# EAGLE design tokaleds (EAGLE 8.5.0)
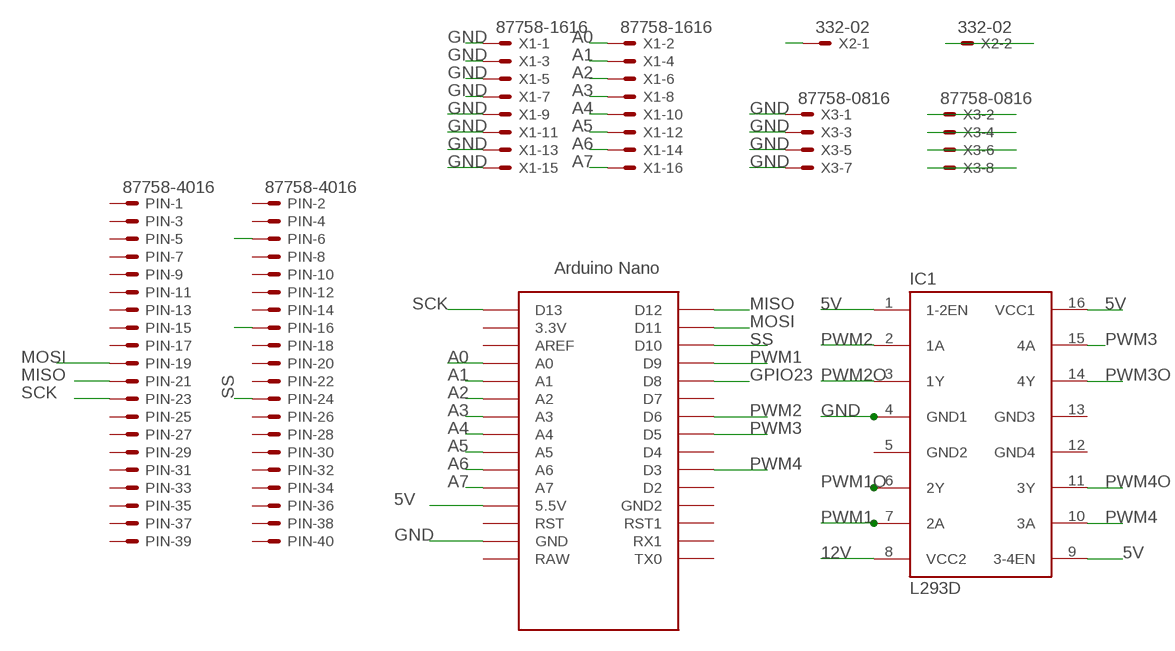
[diagram p0: schematic, sheet 1]

## Parts
IC1  L293D  [DIL16]
PIN  87758-4016  [87758-4016]
U$1  NANO  [NANO]
X1  87758-1616  [87758-1616]
X2  332-02  [332-02]
X3  87758-0816  [87758-0816]

## Nets
5V: IC1.1(1-2EN) IC1.9(3-4EN) IC1.16(VCC1) U$1.5V(5.5V)
12V: IC1.8(VCC2) X2.2
A0: U$1.A0 X1.2
A1: U$1.A1 X1.4
A2: U$1.A2 X1.6
A3: U$1.A3 X1.8
A4: U$1.A4 X1.10
A5: U$1.A5 X1.12
A6: U$1.A6 X1.14
A7: U$1.A7 X1.16
GND: IC1.4(GND1) PIN.6 U$1.GND X1.1 X1.3 X1.5 X1.7 X1.9 X1.11 X1.13 X1.15 X2.1 X3.1 X3.3 X3.5 X3.7
GPIO23: PIN.16 U$1.D8
MISO: PIN.21 U$1.D12
MOSI: PIN.19 U$1.D11
PWM1: IC1.7(2A) U$1.D9
PWM1O: IC1.6(2Y) X3.2
PWM2: IC1.2(1A) U$1.D6
PWM2O: IC1.3(1Y) X3.4
PWM3: IC1.15(4A) U$1.D5
PWM3O: IC1.14(4Y) X3.6
PWM4: IC1.10(3A) U$1.D3
PWM4O: IC1.11(3Y) X3.8
SCK: PIN.23 U$1.D13
SS: PIN.24 U$1.D10
Unconnected: PIN.1 PIN.2 PIN.3 PIN.4 PIN.5 PIN.7 PIN.8 PIN.9 PIN.10 PIN.11 PIN.12 PIN.13 PIN.14 PIN.15 PIN.17 PIN.18 PIN.20 PIN.22 PIN.25 PIN.26 PIN.27 PIN.28 PIN.29 PIN.30 PIN.31 PIN.32 PIN.33 PIN.34 PIN.35 PIN.36 PIN.37 PIN.38 PIN.39 PIN.40 U$1.3.3V U$1.AREF U$1.D2 U$1.D4 U$1.D7 U$1.GND1(GND2) U$1.ICSP1 U$1.ICSP2 U$1.ICSP3 U$1.ICSP4 U$1.ICSP5 U$1.ICSP6 U$1.RAW U$1.RST U$1.RST1 U$1.RX1 U$1.TX0

## Power pins joined to a net without a drawn wire
GND2: IC1.5(GND2)
GND3: IC1.13(GND3)
GND4: IC1.12(GND4)

## Library data of the parts
IC1 = st-microelectronics:L293D: PUSH-PULL 4 CHANNEL DRIVER; MPN: L293D; OC_FARNELL: 9589619; OC_NEWARK: 56P8249
PIN = con-molex:87758-4016: 40 Pin - 2mm Dual Row Single Wafer, Vertical T/H HDR Source: http://www.molex.com/pdm_docs/sd/877580616_sd.pdf; MF: MOLEX; MPN: 87758-4016; OC_FARNELL: unknown; OC_NEWARK: 25M5691
U$1 = Arduino-clone:NANO: Arduino Nano
X1 = con-molex:87758-1616: 16 Pin - 2mm Dual Row Single Wafer, Vertical T/H HDR Source: http://www.molex.com/pdm_docs/sd/877580616_sd.pdf; MF: MOLEX; MPN: 87758-1616; OC_FARNELL: 7472366; OC_NEWARK: 59J1563
X2 = con-garry:332-02: 2 Pin - 2mm Dual Row Source: www.mpe-connector.de / garry_shortform_2012.pdf
X3 = con-molex:87758-0816: 8 Pin - 2mm Dual Row Single Wafer, Vertical T/H HDR Source: http://www.molex.com/pdm_docs/sd/877580616_sd.pdf; MF: MOLEX; MPN: 87758-0816; OC_FARNELL: 7472331; OC_NEWARK: 59J1556

## Board
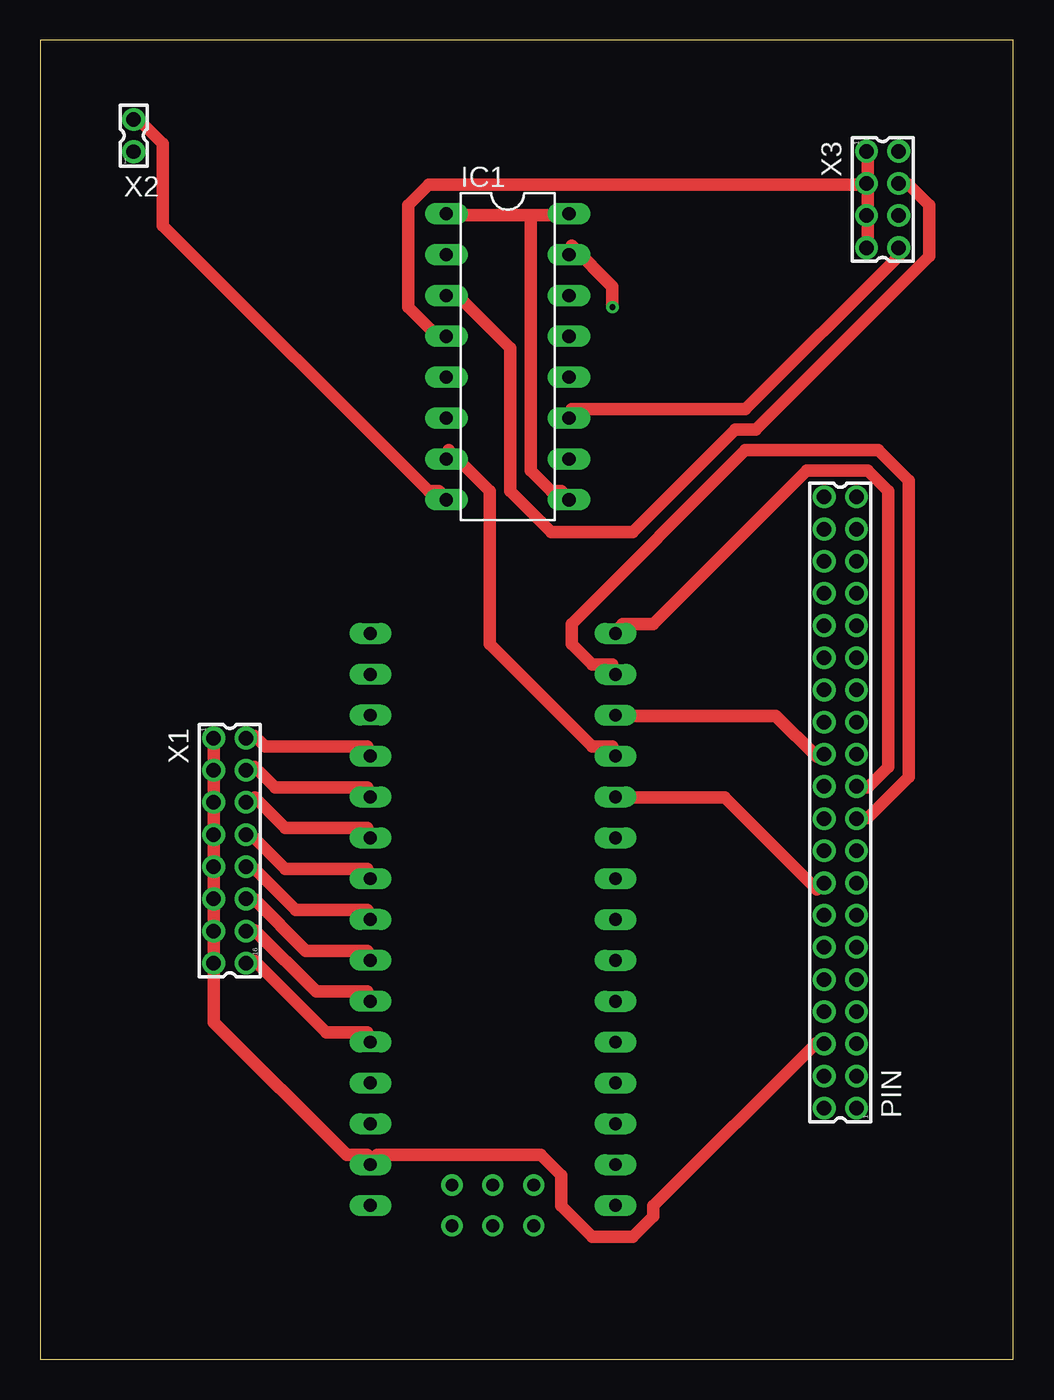
[diagram p1: board, top side]
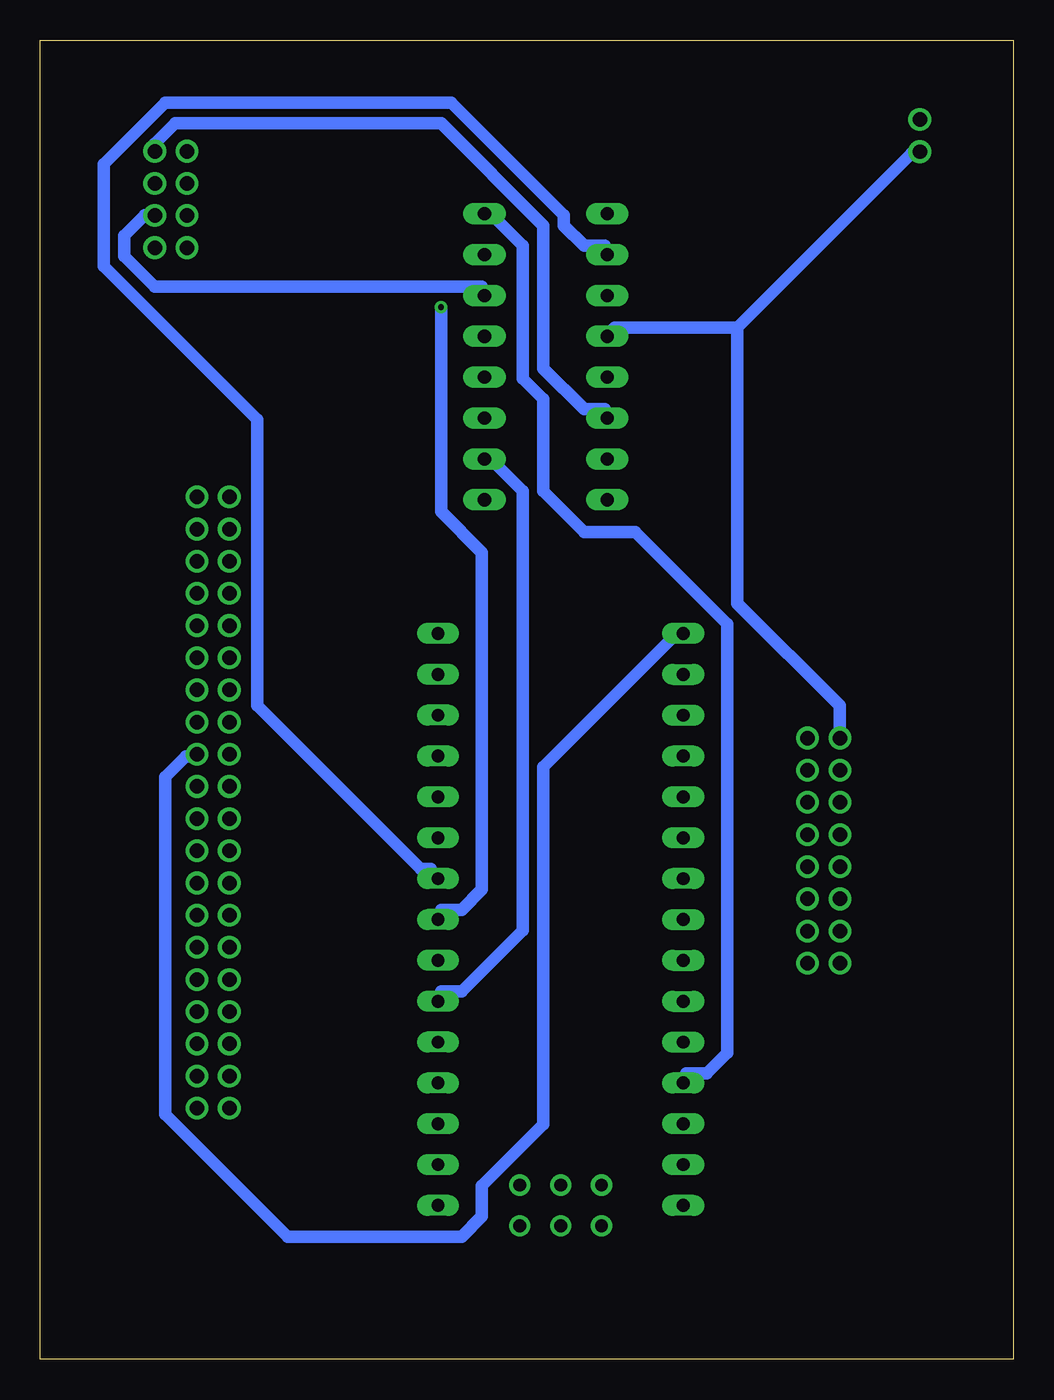
[diagram p2: board, bottom side, seen from below]

Size 60.47 x 82 mm. Coordinates in mm from the lower left corner, seen from the top.
Outline: 0,0 60.47,0 60.47,82 0,82 0,0
Copper layers (1*16): Top 0.035mm / dielectric 1.5mm / Bottom 0.035mm
Design rules "default *": minimum track width 30mil, minimum drill 0.35mm, track to track 20mil, track to pad 20mil, pad to pad 20mil, via to via 20mil, smd to smd 20mil, copper to edge 40mil, drill to drill 6mil, minimum pad ring 10mil, minimum via ring 8mil, stop-mask expansion 4mil, vias tented up to drill 0mil, thermal gap 10mil

### Footprints (pad centres in the part's own frame; a part is rotated, then mirrored left to right if it is on the bottom)
DIL16 = drill 0.813 long: 1 -8.89,-3.81; 2 -6.35,-3.81; 3 -3.81,-3.81; 4 -1.27,-3.81; 5 1.27,-3.81; 6 3.81,-3.81; 7 6.35,-3.81; 8 8.89,-3.81; 9 8.89,3.81; 10 6.35,3.81; 11 3.81,3.81; 12 1.27,3.81; 13 -1.27,3.81; 14 -3.81,3.81; 15 -6.35,3.81; 16 -8.89,3.81
87758-4016 = drill 0.9 pad 1.27: 1 -19,-1; 2 -19,1; 3 -17,-1; 4 -17,1; 5 -15,-1; 6 -15,1; 7 -13,-1; 8 -13,1; 9 -11,-1; 10 -11,1; 11 -9,-1; 12 -9,1; 13 -7,-1; 14 -7,1; 15 -5,-1; 16 -5,1; 17 -3,-1; 18 -3,1; 19 -1,-1; 20 -1,1; 21 1,-1; 22 1,1; 23 3,-1; 24 3,1; 25 5,-1; 26 5,1; 27 7,-1; 28 7,1; 29 9,-1; 30 9,1; 31 11,-1; 32 11,1; 33 13,-1; 34 13,1; 35 15,-1; 36 15,1; 37 17,-1; 38 17,1; 39 19,-1; 40 19,1
NANO = drill 0.8 long: 3.3V -10.16,24.13; 5V -10.16,-1.27; A0 -10.16,19.05; A1 -10.16,16.51; A2 -10.16,13.97; A3 -10.16,11.43; A4 -10.16,8.89; A5 -10.16,6.35; A6 -10.16,3.81; A7 -10.16,1.27; AREF -10.16,21.59; D2 5.08,1.27; D3 5.08,3.81; D4 5.08,6.35; D5 5.08,8.89; D6 5.08,11.43; D7 5.08,13.97; D8 5.08,16.51; D9 5.08,19.05; D10 5.08,21.59; D11 5.08,24.13; D12 5.08,26.67; D13 -10.16,26.67; GND -10.16,-6.35; GND1 5.08,-1.27; RAW -10.16,-8.89; RST -10.16,-3.81; RST1 5.08,-3.81; RX1 5.08,-6.35; TX0 5.08,-8.89 | drill 0.8: ICSP1 -5.08,-10.16; ICSP2 -5.08,-7.62; ICSP3 -2.54,-10.16; ICSP4 -2.54,-7.62; ICSP5 0,-10.16; ICSP6 0,-7.62
87758-1616 = drill 0.9 pad 1.27: 1 -7,-1; 2 -7,1; 3 -5,-1; 4 -5,1; 5 -3,-1; 6 -3,1; 7 -1,-1; 8 -1,1; 9 1,-1; 10 1,1; 11 3,-1; 12 3,1; 13 5,-1; 14 5,1; 15 7,-1; 16 7,1
332-02 = drill 0.9 pad 1.27: 1 0,-1; 2 0,1
87758-0816 = drill 0.9 pad 1.27: 1 -3,-1; 2 -3,1; 3 -1,-1; 4 -1,1; 5 1,-1; 6 1,1; 7 3,-1; 8 3,1

### Placement (x,y rotation side)
IC1  29.05,62.32 270 top
PIN  49.72,34.61 90 top
U$1  30.67,18.45 0 top
X1  11.78,31.62 270 top
X2  5.81,76.07 0 top
X3  52.35,72.1 270 top

### Tracks (layer width: path | path; a pad name or v marks a point on that pad's centre or on a via)
5V
  Top 0.762: 30.48,71.12 32.38,71.12 IC1.16 | 30.48,71.12 25.4,71.12 IC1.1 | 30.48,71.12 30.48,55.24 31.75,53.98 32.38,53.98 IC1.9
  Bottom 0.762: U$1.5V 20.32,17.78 19.05,17.78 17.78,19.05 17.78,45.72 23.5,51.44 26.67,51.44 29.21,53.98 29.21,59.69 30.48,60.96 30.48,69.22 32.38,71.12 IC1.16
12V
  Top 0.762: IC1.8 24.77,53.98 24.13,53.98 7.62,70.48 7.62,75.56 6.35,76.83 X2.2
A0
  Top 0.762: U$1.A0 20.32,38.1 13.97,38.1 13.34,38.73 X1.2
A1
  Top 0.762: U$1.A1 20.32,35.56 14.61,35.56 13.34,36.83 X1.4
A2
  Top 0.762: U$1.A2 20.32,33.02 15.24,33.02 13.34,34.92 X1.6
A3
  Top 0.762: U$1.A3 20.32,30.48 15.24,30.48 13.34,32.38 X1.8
A4
  Top 0.762: U$1.A4 20.32,27.94 15.88,27.94 13.34,30.48 X1.10
A5
  Top 0.762: U$1.A5 20.32,25.4 16.51,25.4 13.34,28.57 X1.12
A6
  Top 0.762: U$1.A6 20.32,22.86 17.14,22.86 13.34,26.67 X1.14
A7
  Top 0.762: U$1.A7 20.32,20.32 17.78,20.32 13.34,24.77 X1.16
GND
  Top 0.762: X3.7 51.44,69.22 51.44,70.48 X3.5 51.44,71.12 51.44,73.03 X3.3 | X3.3 51.44,73.66 51.44,74.93 X3.1 | X3.3 50.8,73.03 24.13,73.03 22.86,71.75 22.86,65.41 24.77,63.5 IC1.4 | X1.1 10.79,38.1 10.79,36.83 X1.3 10.79,36.2 10.79,34.92 X1.5 10.79,34.29 10.79,33.02 X1.7 10.79,32.38 10.79,31.11 X1.9 10.79,30.48 10.79,29.21 X1.11 10.79,28.57 10.79,26.67 X1.13 10.79,26.04 10.79,24.77 X1.15 10.79,24.13 10.79,20.95 19.05,12.7 20.32,12.7 U$1.GND 20.95,12.7 31.11,12.7 32.38,11.43 32.38,9.53 34.29,7.62 36.83,7.62 38.1,8.89 38.1,9.53 48.26,19.68 PIN.6
  Bottom 0.762: 17.14,64.14 24.77,64.14 IC1.4 | 17.14,64.14 6.35,74.93 X2.1 | 17.14,64.14 17.14,46.99 10.79,40.64 10.79,38.73 X1.1
GPIO23
  Top 0.762: U$1.D8 36.2,34.92 42.55,34.92 48.26,29.21 PIN.16
MISO
  Top 0.762: U$1.D12 36.2,45.72 38.1,45.72 47.62,55.24 51.44,55.24 52.7,53.98 52.7,36.83 51.44,35.56 50.8,35.56 PIN.21
MOSI
  Top 0.762: U$1.D11 35.56,43.18 34.29,43.18 33.02,44.45 33.02,45.72 43.81,56.52 52.07,56.52 53.98,54.61 53.98,36.2 51.44,33.66 50.8,33.66 PIN.19
PWM1
  Top 0.762: U$1.D9 35.56,38.1 34.29,38.1 27.94,44.45 27.94,53.98 25.4,56.52 IC1.7
PWM1O
  Bottom 0.762: IC1.6 25.4,59.05 26.67,59.05 29.21,61.59 29.21,70.48 35.56,76.83 52.07,76.83 53.34,75.56 X3.2
PWM2
  Bottom 0.762: U$1.D6 36.2,30.48 36.83,30.48 46.99,40.64 46.99,58.42 56.52,67.94 56.52,74.3 52.7,78.11 34.92,78.11 27.94,71.12 27.94,70.48 26.67,69.22 25.4,69.22 IC1.2
PWM2O
  Top 0.762: IC1.3 25.4,66.04 26.04,66.04 29.21,62.87 29.21,53.98 31.75,51.44 36.83,51.44 43.18,57.78 44.45,57.78 55.24,68.58 55.24,71.75 53.98,73.03 X3.4
PWM3  (via drill 0.35)
  Top 0.762: v35.56,65.41 35.56,66.67 33.02,69.22 IC1.15
  Bottom 0.762: v35.56,65.41 35.56,52.7 33.02,50.16 33.02,29.21 34.29,27.94 35.56,27.94 U$1.D5
PWM3O
  Bottom 0.762: IC1.14 33.02,66.67 53.34,66.67 55.24,68.58 55.24,69.85 53.98,71.12 X3.6
PWM4
  Bottom 0.762: U$1.D3 35.56,22.86 34.29,22.86 30.48,26.67 30.48,53.98 32.38,55.88 IC1.10
PWM4O
  Top 0.762: IC1.11 33.02,59.05 43.81,59.05 53.34,68.58 X3.8
SCK
  Bottom 0.762: U$1.D13 20.95,45.09 29.21,36.83 29.21,14.61 33.02,10.79 33.02,8.89 34.29,7.62 45.09,7.62 52.7,15.24 52.7,36.2 51.44,37.47 50.8,37.47 PIN.23
SS
  Top 0.762: U$1.D10 36.2,40.01 45.72,40.01 48.26,37.47 PIN.24